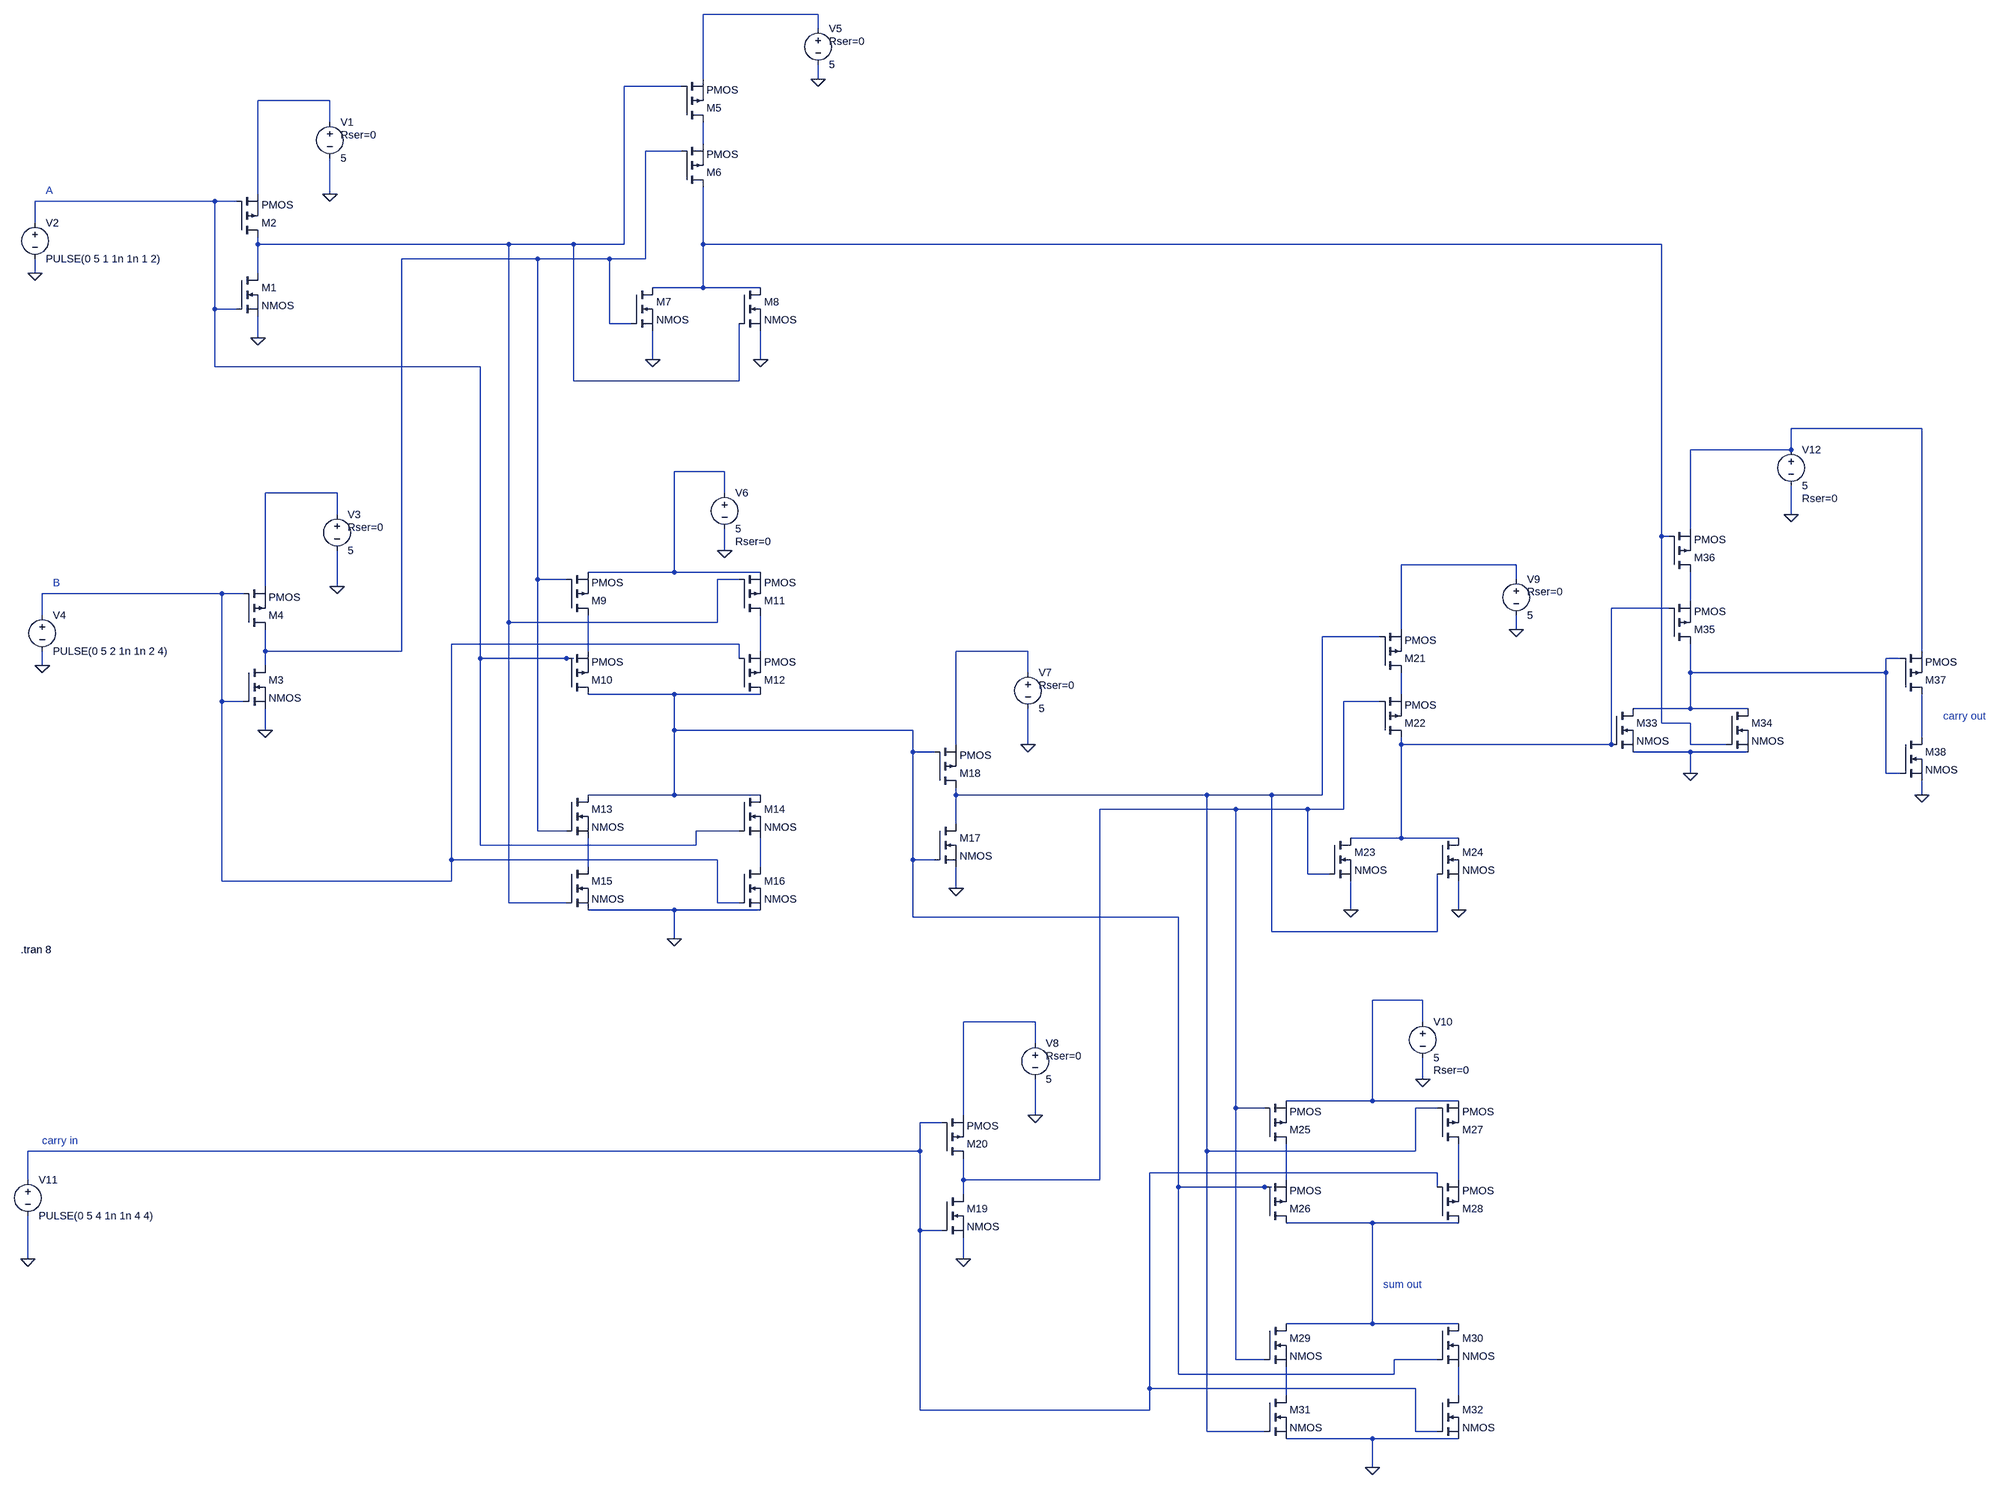
[diagram p0: schematic Full Adder.asc]
Full Adder.asc, the LTspice schematic file:
Version 4.1
SHEET 1 5072 2964
WIRE 832 -352 576 -352
WIRE 832 -320 832 -352
WIRE 576 -208 576 -352
WIRE 832 -208 832 -240
WIRE 528 -192 400 -192
WIRE -416 -160 -576 -160
WIRE -416 -112 -416 -160
WIRE 576 -64 576 -112
WIRE 528 -48 448 -48
WIRE -576 48 -576 -160
WIRE -416 48 -416 -32
WIRE -672 64 -1072 64
WIRE -624 64 -672 64
WIRE -1072 112 -1072 64
WIRE -576 160 -576 144
WIRE 144 160 -576 160
WIRE 288 160 144 160
WIRE 400 160 400 -192
WIRE 400 160 288 160
WIRE 576 160 576 32
WIRE 3744 160 576 160
WIRE 208 192 -256 192
WIRE 368 192 208 192
WIRE 448 192 448 -48
WIRE 448 192 368 192
WIRE -1072 224 -1072 192
WIRE -576 224 -576 160
WIRE 576 256 576 160
WIRE 576 256 464 256
WIRE 704 256 576 256
WIRE -672 304 -672 64
WIRE -624 304 -672 304
WIRE 368 336 368 192
WIRE 416 336 368 336
WIRE -576 368 -576 320
WIRE 464 416 464 352
WIRE 704 416 704 352
WIRE -672 432 -672 304
WIRE 80 432 -672 432
WIRE 288 464 288 160
WIRE 656 464 656 336
WIRE 656 464 288 464
WIRE 4416 576 4032 576
WIRE 4032 624 4032 576
WIRE 4032 624 3808 624
WIRE 624 672 512 672
WIRE -400 720 -560 720
WIRE 624 720 624 672
WIRE -400 768 -400 720
WIRE 4032 768 4032 704
WIRE 3808 800 3808 624
WIRE 3744 816 3744 160
WIRE 3760 816 3744 816
WIRE 624 848 624 800
WIRE 2992 880 2736 880
WIRE 512 896 512 672
WIRE 512 896 320 896
WIRE 704 896 512 896
WIRE 208 912 208 192
WIRE 272 912 208 912
WIRE 656 912 608 912
WIRE 2992 912 2992 880
WIRE -560 928 -560 720
WIRE -400 928 -400 848
WIRE -656 944 -1056 944
WIRE -608 944 -656 944
WIRE 3808 960 3808 896
WIRE 3760 976 3632 976
WIRE -1056 992 -1056 944
WIRE 144 1008 144 160
WIRE 608 1008 608 912
WIRE 608 1008 144 1008
WIRE 2736 1024 2736 880
WIRE 2992 1024 2992 992
WIRE 2688 1040 2560 1040
WIRE 656 1056 16 1056
WIRE -560 1072 -560 1024
WIRE -256 1072 -256 192
WIRE -256 1072 -560 1072
WIRE 320 1072 320 992
WIRE 704 1072 704 992
WIRE 1744 1072 1584 1072
WIRE 4416 1072 4416 576
WIRE 80 1088 80 432
WIRE 272 1088 80 1088
WIRE 288 1088 272 1088
WIRE 656 1088 656 1056
WIRE 4368 1088 4336 1088
WIRE -1056 1104 -1056 1072
WIRE -560 1104 -560 1072
WIRE 1744 1120 1744 1072
WIRE 3808 1120 3808 1056
WIRE 4336 1120 4336 1088
WIRE 4336 1120 3808 1120
WIRE 512 1168 320 1168
WIRE 704 1168 512 1168
WIRE 2736 1168 2736 1120
WIRE -656 1184 -656 944
WIRE -608 1184 -656 1184
WIRE 2688 1184 2608 1184
WIRE 3808 1200 3808 1120
WIRE 3808 1200 3680 1200
WIRE 3936 1200 3808 1200
WIRE 3744 1232 3744 816
WIRE 3808 1232 3744 1232
WIRE -560 1248 -560 1200
WIRE 512 1248 512 1168
WIRE 1488 1248 512 1248
WIRE 4416 1264 4416 1168
WIRE 1584 1280 1584 1072
WIRE 1744 1280 1744 1200
WIRE 2736 1280 2736 1264
WIRE 3632 1280 3632 976
WIRE 3632 1280 2736 1280
WIRE 3808 1280 3808 1232
WIRE 3888 1280 3808 1280
WIRE 1488 1296 1488 1248
WIRE 1536 1296 1488 1296
WIRE 3808 1296 3680 1296
WIRE 3936 1296 3808 1296
WIRE 3808 1344 3808 1296
WIRE 4336 1344 4336 1120
WIRE 4368 1344 4336 1344
WIRE 512 1392 512 1248
WIRE 512 1392 320 1392
WIRE 704 1392 512 1392
WIRE 1584 1392 1584 1376
WIRE 2304 1392 1584 1392
WIRE 2448 1392 2304 1392
WIRE 2560 1392 2560 1040
WIRE 2560 1392 2448 1392
WIRE 4416 1392 4416 1360
WIRE 2368 1424 1904 1424
WIRE 2528 1424 2368 1424
WIRE 2608 1424 2608 1184
WIRE 2608 1424 2528 1424
WIRE 1584 1456 1584 1392
WIRE 208 1472 208 912
WIRE 272 1472 208 1472
WIRE 656 1472 560 1472
WIRE 2736 1488 2736 1280
WIRE 2736 1488 2624 1488
WIRE 2864 1488 2736 1488
WIRE 80 1504 80 1088
WIRE 560 1504 560 1472
WIRE 560 1504 80 1504
WIRE 16 1536 16 1056
WIRE 608 1536 16 1536
WIRE 1488 1536 1488 1296
WIRE 1536 1536 1488 1536
WIRE 320 1552 320 1488
WIRE 704 1552 704 1488
WIRE 2528 1568 2528 1424
WIRE 2576 1568 2528 1568
WIRE -656 1584 -656 1184
WIRE 16 1584 16 1536
WIRE 16 1584 -656 1584
WIRE 1584 1600 1584 1552
WIRE 144 1632 144 1008
WIRE 272 1632 144 1632
WIRE 608 1632 608 1536
WIRE 656 1632 608 1632
WIRE 512 1648 320 1648
WIRE 704 1648 512 1648
WIRE 2624 1648 2624 1584
WIRE 2864 1648 2864 1584
WIRE 1488 1664 1488 1536
WIRE 2240 1664 1488 1664
WIRE 2448 1696 2448 1392
WIRE 2816 1696 2816 1568
WIRE 2816 1696 2448 1696
WIRE 512 1712 512 1648
WIRE 2784 1904 2672 1904
WIRE 1760 1952 1600 1952
WIRE 2784 1952 2784 1904
WIRE 1760 2000 1760 1952
WIRE 2784 2080 2784 2032
WIRE 2672 2128 2672 1904
WIRE 2672 2128 2480 2128
WIRE 2864 2128 2672 2128
WIRE 2368 2144 2368 1424
WIRE 2432 2144 2368 2144
WIRE 2816 2144 2768 2144
WIRE 1600 2160 1600 1952
WIRE 1760 2160 1760 2080
WIRE 1552 2176 1504 2176
WIRE 1504 2240 1504 2176
WIRE 1504 2240 -1088 2240
WIRE 2304 2240 2304 1392
WIRE 2768 2240 2768 2144
WIRE 2768 2240 2304 2240
WIRE 2816 2288 2176 2288
WIRE -1088 2304 -1088 2240
WIRE 1600 2304 1600 2256
WIRE 1904 2304 1904 1424
WIRE 1904 2304 1600 2304
WIRE 2480 2304 2480 2224
WIRE 2864 2304 2864 2224
WIRE 2240 2320 2240 1664
WIRE 2432 2320 2240 2320
WIRE 2448 2320 2432 2320
WIRE 2816 2320 2816 2288
WIRE 1600 2336 1600 2304
WIRE 2672 2400 2480 2400
WIRE 2864 2400 2672 2400
WIRE 1504 2416 1504 2240
WIRE 1552 2416 1504 2416
WIRE -1088 2480 -1088 2384
WIRE 1600 2480 1600 2432
WIRE 2672 2624 2672 2400
WIRE 2672 2624 2480 2624
WIRE 2864 2624 2672 2624
WIRE 2368 2704 2368 2144
WIRE 2432 2704 2368 2704
WIRE 2816 2704 2720 2704
WIRE 2240 2736 2240 2320
WIRE 2720 2736 2720 2704
WIRE 2720 2736 2240 2736
WIRE 2176 2768 2176 2288
WIRE 2768 2768 2176 2768
WIRE 2480 2784 2480 2720
WIRE 2864 2784 2864 2720
WIRE 1504 2816 1504 2416
WIRE 2176 2816 2176 2768
WIRE 2176 2816 1504 2816
WIRE 2304 2864 2304 2240
WIRE 2432 2864 2304 2864
WIRE 2768 2864 2768 2768
WIRE 2816 2864 2768 2864
WIRE 2672 2880 2480 2880
WIRE 2864 2880 2672 2880
WIRE 2672 2944 2672 2880
FLAG -576 368 0
FLAG -416 48 0
FLAG -1072 224 0
FLAG -560 1248 0
FLAG -400 928 0
FLAG -1056 1104 0
FLAG 832 -208 0
FLAG 464 416 0
FLAG 704 416 0
FLAG 512 1712 0
FLAG 624 848 0
FLAG 1584 1600 0
FLAG 1744 1280 0
FLAG 1600 2480 0
FLAG 1760 2160 0
FLAG 2992 1024 0
FLAG 2624 1648 0
FLAG 2864 1648 0
FLAG 2672 2944 0
FLAG 2784 2080 0
FLAG -1088 2480 0
FLAG 3808 1344 0
FLAG 4032 768 0
FLAG 4416 1392 0
SYMBOL nmos -624 224 R0
SYMATTR InstName M1
SYMBOL pmos -624 144 M180
SYMATTR InstName M2
SYMBOL voltage -416 -128 R0
WINDOW 123 0 0 Left 0
WINDOW 39 24 44 Left 2
SYMATTR InstName V1
SYMATTR Value 5
SYMATTR SpiceLine Rser=0
SYMBOL voltage -1072 96 R0
WINDOW 123 0 0 Left 0
WINDOW 39 0 0 Left 0
SYMATTR InstName V2
SYMATTR Value PULSE(0 5 1 1n 1n 1 2)
SYMBOL nmos -608 1104 R0
SYMATTR InstName M3
SYMBOL pmos -608 1024 M180
SYMATTR InstName M4
SYMBOL voltage -400 752 R0
WINDOW 123 0 0 Left 0
WINDOW 39 24 44 Left 2
SYMATTR InstName V3
SYMATTR Value 5
SYMATTR SpiceLine Rser=0
SYMBOL voltage -1056 976 R0
WINDOW 123 0 0 Left 0
WINDOW 39 0 0 Left 0
SYMATTR InstName V4
SYMATTR Value PULSE(0 5 2 1n 1n 2 4)
SYMBOL pmos 528 -112 M180
SYMATTR InstName M5
SYMBOL pmos 528 32 M180
SYMATTR InstName M6
SYMBOL voltage 832 -336 R0
WINDOW 123 0 0 Left 0
WINDOW 39 24 44 Left 2
SYMATTR InstName V5
SYMATTR Value 5
SYMATTR SpiceLine Rser=0
SYMBOL nmos 416 256 R0
SYMATTR InstName M7
SYMBOL nmos 656 256 R0
SYMATTR InstName M8
SYMBOL pmos 272 992 M180
SYMATTR InstName M9
SYMBOL pmos 272 1168 M180
SYMATTR InstName M10
SYMBOL pmos 656 992 M180
SYMATTR InstName M11
SYMBOL pmos 656 1168 M180
SYMATTR InstName M12
SYMBOL nmos 272 1392 R0
SYMATTR InstName M13
SYMBOL nmos 656 1392 R0
SYMATTR InstName M14
SYMBOL nmos 272 1552 R0
SYMATTR InstName M15
SYMBOL nmos 656 1552 R0
SYMATTR InstName M16
SYMBOL voltage 624 704 R0
WINDOW 123 0 0 Left 0
WINDOW 39 24 124 Left 2
SYMATTR InstName V6
SYMATTR Value 5
SYMATTR SpiceLine Rser=0
SYMBOL nmos 1536 1456 R0
SYMATTR InstName M17
SYMBOL pmos 1536 1376 M180
SYMATTR InstName M18
SYMBOL voltage 1744 1104 R0
WINDOW 123 0 0 Left 0
WINDOW 39 24 44 Left 2
SYMATTR InstName V7
SYMATTR Value 5
SYMATTR SpiceLine Rser=0
SYMBOL nmos 1552 2336 R0
SYMATTR InstName M19
SYMBOL pmos 1552 2256 M180
SYMATTR InstName M20
SYMBOL voltage 1760 1984 R0
WINDOW 123 0 0 Left 0
WINDOW 39 24 44 Left 2
SYMATTR InstName V8
SYMATTR Value 5
SYMATTR SpiceLine Rser=0
SYMBOL pmos 2688 1120 M180
SYMATTR InstName M21
SYMBOL pmos 2688 1264 M180
SYMATTR InstName M22
SYMBOL voltage 2992 896 R0
WINDOW 123 0 0 Left 0
WINDOW 39 24 44 Left 2
SYMATTR InstName V9
SYMATTR Value 5
SYMATTR SpiceLine Rser=0
SYMBOL nmos 2576 1488 R0
SYMATTR InstName M23
SYMBOL nmos 2816 1488 R0
SYMATTR InstName M24
SYMBOL pmos 2432 2224 M180
SYMATTR InstName M25
SYMBOL pmos 2432 2400 M180
SYMATTR InstName M26
SYMBOL pmos 2816 2224 M180
SYMATTR InstName M27
SYMBOL pmos 2816 2400 M180
SYMATTR InstName M28
SYMBOL nmos 2432 2624 R0
SYMATTR InstName M29
SYMBOL nmos 2816 2624 R0
SYMATTR InstName M30
SYMBOL nmos 2432 2784 R0
SYMATTR InstName M31
SYMBOL nmos 2816 2784 R0
SYMATTR InstName M32
SYMBOL voltage 2784 1936 R0
WINDOW 123 0 0 Left 0
WINDOW 39 24 124 Left 2
SYMATTR InstName V10
SYMATTR Value 5
SYMATTR SpiceLine Rser=0
SYMBOL voltage -1088 2288 R0
WINDOW 123 0 0 Left 0
WINDOW 39 0 0 Left 0
SYMATTR InstName V11
SYMATTR Value PULSE(0 5 4 1n 1n 4 4)
SYMBOL nmos 3632 1200 R0
SYMATTR InstName M33
SYMBOL nmos 3888 1200 R0
SYMATTR InstName M34
SYMBOL pmos 3760 1056 M180
SYMATTR InstName M35
SYMBOL pmos 3760 896 M180
SYMATTR InstName M36
SYMBOL voltage 4032 608 R0
WINDOW 123 0 0 Left 0
WINDOW 39 24 124 Left 2
SYMATTR InstName V12
SYMATTR Value 5
SYMATTR SpiceLine Rser=0
SYMBOL pmos 4368 1168 M180
SYMATTR InstName M37
SYMBOL nmos 4368 1264 R0
SYMATTR InstName M38
TEXT -1048 40 Left 2 ;A
TEXT -1032 920 Left 2 ;B
TEXT -1104 1736 Left 2 !.tran 8
TEXT 4464 1216 Left 2 ;carry out
TEXT 2696 2536 Left 2 ;sum out
TEXT -1056 2216 Left 2 ;carry in

The netlist it stands for:
* Full Adder.asc
M1 N002 N006 0 0 NMOS
M2 N002 N006 N003 N003 PMOS
V1 N003 0 5 Rser=0
V2 N006 0 PULSE(0 5 1 1n 1n 1 2)
M3 N005 N012 0 0 NMOS
M4 N005 N012 N010 N010 PMOS
V3 N010 0 5 Rser=0
V4 N012 0 PULSE(0 5 2 1n 1n 2 4)
M5 N004 N002 N001 N001 PMOS
M6 N007 N005 N004 N004 PMOS
V5 N001 0 5 Rser=0
M7 N007 N005 0 0 NMOS
M8 N007 N002 0 0 NMOS
M9 N016 N005 N009 N009 PMOS
M10 N020 N006 N016 N016 PMOS
M11 N017 N002 N009 N009 PMOS
M12 N020 N012 N017 N017 PMOS
M13 N020 N005 N024 N024 NMOS
M14 N020 N006 N025 N025 NMOS
M15 N024 N002 0 0 NMOS
M16 N025 N012 0 0 NMOS
V6 N009 0 5 Rser=0
M17 N015 N020 0 0 NMOS
M18 N015 N020 N018 N018 PMOS
V7 N018 0 5 Rser=0
M19 N022 N028 0 0 NMOS
M20 N022 N028 N027 N027 PMOS
V8 N027 0 5 Rser=0
M21 N021 N015 N011 N011 PMOS
M22 N014 N022 N021 N021 PMOS
V9 N011 0 5 Rser=0
M23 N014 N022 0 0 NMOS
M24 N014 N015 0 0 NMOS
M25 N029 N022 N026 N026 PMOS
M26 N031 N020 N029 N029 PMOS
M27 N030 N015 N026 N026 PMOS
M28 N031 N028 N030 N030 PMOS
M29 N031 N022 N032 N032 NMOS
M30 N031 N020 N033 N033 NMOS
M31 N032 N015 0 0 NMOS
M32 N033 N028 0 0 NMOS
V10 N026 0 5 Rser=0
V11 N028 0 PULSE(0 5 4 1n 1n 4 4)
M33 N019 N014 0 0 NMOS
M34 N019 N007 0 0 NMOS
M35 N019 N014 N013 N013 PMOS
M36 N013 N007 N008 N008 PMOS
V12 N008 0 5 Rser=0
M37 N023 N019 N008 N008 PMOS
M38 N023 N019 0 0 NMOS
.model NMOS NMOS
.model PMOS PMOS
.lib standard.mos
* A
* B
.tran 8
* carry out
* sum out
* carry in
.backanno
.end